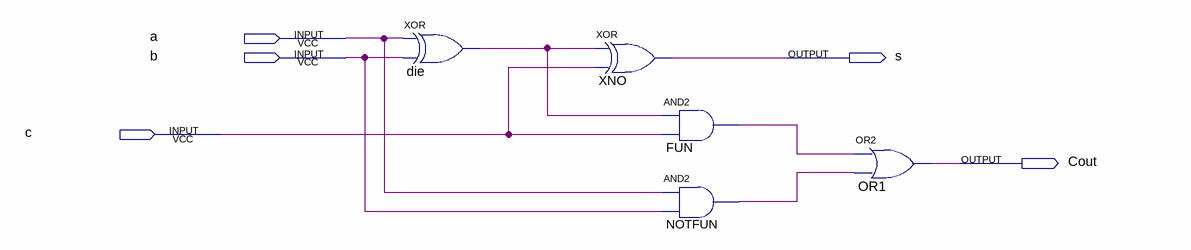
[diagram p0: schematic sheet]
// Quartus schematic i_want_to_kys.bdf as structural Verilog: 5 symbols, 5 pins
module i_want_to_kys (
  input  a,
  input  b,
  input  c,
  output s,
  output Cout
);

  wire die_out, FUN_out, NOTFUN_out;

  xor die (die_out, a, b);
  xor XNO (s, die_out, c);
  and FUN (FUN_out, die_out, c);
  and NOTFUN (NOTFUN_out, a, b);
  or OR1 (Cout, FUN_out, NOTFUN_out);
endmodule
